# Altium schematic sheet [2]- Connector_Page.SchDoc: STM Bluepill
size A4; DrawnBy: Aviral Mishra; DocumentNumber: 2; Revision: V1.0; SheetNumber: 2; SheetTotal: 2; Company Name: Esteem PCB
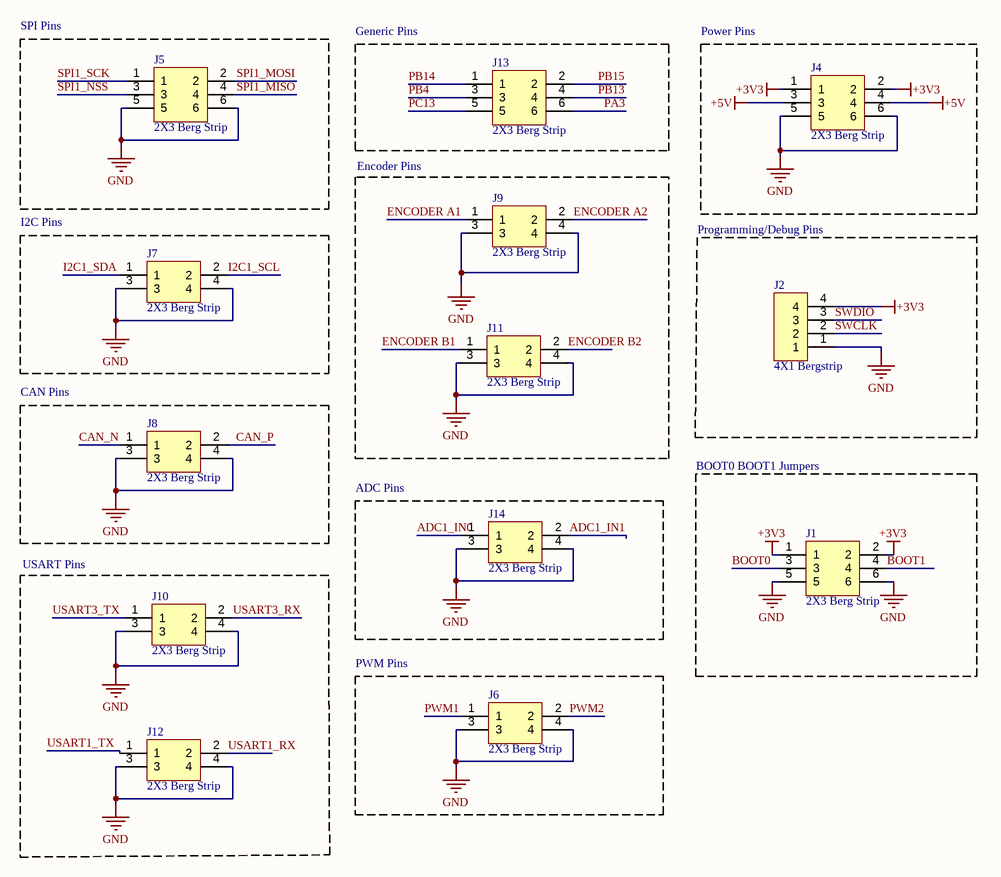
[diagram p0: [2]- Connector_Page.SchDoc]

## Parts
J1  2X3 Berg Strip  [CON6_100_59D78_TH_ST_Duplicate]
J2  4X1 Bergstrip  [CON4_100_40D72_TH_ST_MALE]
J4  2X3 Berg Strip  [CON6_100_59D78_TH_ST_Duplicate]
J5  2X3 Berg Strip  [CON6_100_59D78_TH_ST_Duplicate]
J6  2X3 Berg Strip  [CON4_100_59D78_TH_ST_Duplicate]
J7  2X3 Berg Strip  [CON4_100_59D78_TH_ST_Duplicate]
J8  2X3 Berg Strip  [CON4_100_59D78_TH_ST_Duplicate]
J9  2X3 Berg Strip  [CON4_100_59D78_TH_ST_Duplicate]
J10  2X3 Berg Strip  [CON4_100_59D78_TH_ST_Duplicate]
J11  2X3 Berg Strip  [CON4_100_59D78_TH_ST_Duplicate]
J12  2X3 Berg Strip  [CON4_100_59D78_TH_ST_Duplicate]
J13  2X3 Berg Strip  [CON6_100_59D78_TH_ST_Duplicate]
J14  2X3 Berg Strip  [CON4_100_59D78_TH_ST_Duplicate]

## Blocks framed on the sheet
SPI Pins: J5
Generic Pins: J13
Power Pins: J4
Encoder Pins: J9 J11
I2C Pins: J7
Programming/Debug Pins: J2
CAN Pins: J8
BOOT0 BOOT1 Jumpers: J1
ADC Pins: J14
USART Pins: J10 J12
PWM Pins: J6

## Nets
+3V3: J1.1 J1.2 J2.4 J4.1 J4.2
+5V: J4.3 J4.4
GND: J1.5 J1.6 J2.1 J4.5 J4.6 J5.5 J5.6 J6.3 J6.4 J7.3 J7.4 J8.3 J8.4 J9.3 J9.4 J10.3 J10.4 J11.3 J11.4 J12.3 J12.4 J14.3 J14.4
ADC1_IN0: J14.1
ADC1_IN1: J14.2
BOOT0: J1.3
BOOT1: J1.4
CAN_N: J8.1
CAN_P: J8.2
ENCODER A1: J9.1
ENCODER A2: J9.2
ENCODER B1: J11.1
ENCODER B2: J11.2
I2C1_SCL: J7.2
I2C1_SDA: J7.1
PA3: J13.6
PB4: J13.3
PB13: J13.4
PB14: J13.1
PB15: J13.2
PC13: J13.5
PWM1: J6.1
PWM2: J6.2
SPI1_MISO: J5.4
SPI1_MOSI: J5.2
SPI1_NSS: J5.3
SPI1_SCK: J5.1
SWCLK: J2.2
SWDIO: J2.3
USART1_RX: J12.2
USART1_TX: J12.1
USART3_RX: J10.2
USART3_TX: J10.1

## Notes on the sheet
- DWG. NO.
- REV.
- SHT.
- THIS DOCUMENT AND THE DATA DISCLOSED HEREIN OR HEREWITH IS THE PROPERTY OF ALTIUM LIMITED AND MAY BE FREELY DISTRIBUTED IN WHOLE. NO RIGHTS ARE RESERVED OR EXPRESS OR IMPLIED WARANTEE GIVEN.
- REVISION
- DESCRIPTION
- DATE
- APPROVED
- ENG:
- APPROVALS
- PROJECT
- DSN:
- CHK:
- REFERENCE DOCUMENTS
- PROJECT REVISION:
- TITLE
- DOCUMENT REVISION:
- DESIGN ITEM:
- BOM:
- FAB DWG:
- PCB DWG:
- ASSY DWG:
- SCALE:
- SIZE
- B
- CAGE CODE
- FILE NAME
- DWG NO.
- SHEET
- OF
- REV

## Library data of the parts
J1 J4 J5 J13 = CON-BS-PLG_2X3-100-TH-ST: 6 pin, 2 row, 2.54mm pitch bergstrip; Manufacturer: NA; Manufacturer Part Number: NA; Case/Package: TH; Supplier-1: NA; Supplier Part Number-1: NA
J2 = CON-BS-PLG_4X1-100-TH-ST: 4 pin, 1 row, 2.54mm pitch bergstrip; Manufacturer: NA; Manufacturing Part Number: NA; Case/Package: TH; Supplier-1: NA; Supplier Part Number-1: NA
J6-J12 J14 = CON-BS-PLG_2X2-100-TH-ST: 4 pin, 2 row, 2.54mm pitch bergstrip